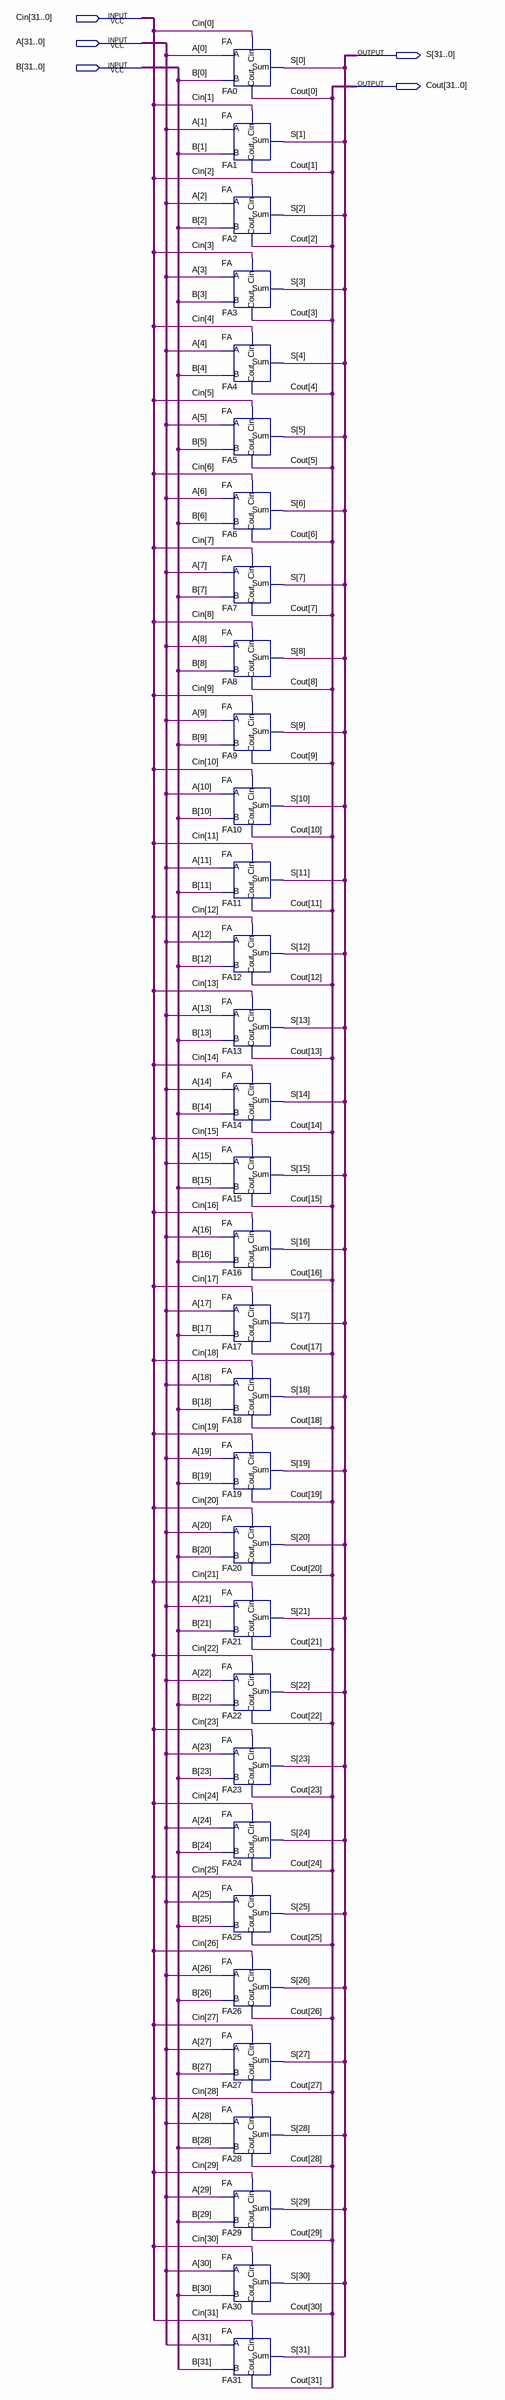
[diagram p0: schematic sheet]
// Quartus schematic CAS_32.bdf as structural Verilog: 32 symbols, 5 pins
module CAS_32 (
  input  [31:0] Cin,
  input  [31:0] A,
  input  [31:0] B,
  output [31:0] S,
  output [31:0] Cout
);

  FA FA0 (.A(A[0]), .B(B[0]), .Cin(Cin[0]), .Sum(S[0]), .Cout(Cout[0]));
  FA FA1 (.A(A[1]), .B(B[1]), .Cin(Cin[1]), .Sum(S[1]), .Cout(Cout[1]));
  FA FA2 (.A(A[2]), .B(B[2]), .Cin(Cin[2]), .Sum(S[2]), .Cout(Cout[2]));
  FA FA3 (.A(A[3]), .B(B[3]), .Cin(Cin[3]), .Sum(S[3]), .Cout(Cout[3]));
  FA FA4 (.A(A[4]), .B(B[4]), .Cin(Cin[4]), .Sum(S[4]), .Cout(Cout[4]));
  FA FA5 (.A(A[5]), .B(B[5]), .Cin(Cin[5]), .Sum(S[5]), .Cout(Cout[5]));
  FA FA6 (.A(A[6]), .B(B[6]), .Cin(Cin[6]), .Sum(S[6]), .Cout(Cout[6]));
  FA FA7 (.A(A[7]), .B(B[7]), .Cin(Cin[7]), .Sum(S[7]), .Cout(Cout[7]));
  FA FA8 (.A(A[8]), .B(B[8]), .Cin(Cin[8]), .Sum(S[8]), .Cout(Cout[8]));
  FA FA9 (.A(A[9]), .B(B[9]), .Cin(Cin[9]), .Sum(S[9]), .Cout(Cout[9]));
  FA FA10 (.A(A[10]), .B(B[10]), .Cin(Cin[10]), .Sum(S[10]), .Cout(Cout[10]));
  FA FA11 (.A(A[11]), .B(B[11]), .Cin(Cin[11]), .Sum(S[11]), .Cout(Cout[11]));
  FA FA12 (.A(A[12]), .B(B[12]), .Cin(Cin[12]), .Sum(S[12]), .Cout(Cout[12]));
  FA FA13 (.A(A[13]), .B(B[13]), .Cin(Cin[13]), .Sum(S[13]), .Cout(Cout[13]));
  FA FA14 (.A(A[14]), .B(B[14]), .Cin(Cin[14]), .Sum(S[14]), .Cout(Cout[14]));
  FA FA15 (.A(A[15]), .B(B[15]), .Cin(Cin[15]), .Sum(S[15]), .Cout(Cout[15]));
  FA FA16 (.A(A[16]), .B(B[16]), .Cin(Cin[16]), .Sum(S[16]), .Cout(Cout[16]));
  FA FA17 (.A(A[17]), .B(B[17]), .Cin(Cin[17]), .Sum(S[17]), .Cout(Cout[17]));
  FA FA18 (.A(A[18]), .B(B[18]), .Cin(Cin[18]), .Sum(S[18]), .Cout(Cout[18]));
  FA FA19 (.A(A[19]), .B(B[19]), .Cin(Cin[19]), .Sum(S[19]), .Cout(Cout[19]));
  FA FA20 (.A(A[20]), .B(B[20]), .Cin(Cin[20]), .Sum(S[20]), .Cout(Cout[20]));
  FA FA21 (.A(A[21]), .B(B[21]), .Cin(Cin[21]), .Sum(S[21]), .Cout(Cout[21]));
  FA FA22 (.A(A[22]), .B(B[22]), .Cin(Cin[22]), .Sum(S[22]), .Cout(Cout[22]));
  FA FA23 (.A(A[23]), .B(B[23]), .Cin(Cin[23]), .Sum(S[23]), .Cout(Cout[23]));
  FA FA24 (.A(A[24]), .B(B[24]), .Cin(Cin[24]), .Sum(S[24]), .Cout(Cout[24]));
  FA FA25 (.A(A[25]), .B(B[25]), .Cin(Cin[25]), .Sum(S[25]), .Cout(Cout[25]));
  FA FA26 (.A(A[26]), .B(B[26]), .Cin(Cin[26]), .Sum(S[26]), .Cout(Cout[26]));
  FA FA27 (.A(A[27]), .B(B[27]), .Cin(Cin[27]), .Sum(S[27]), .Cout(Cout[27]));
  FA FA28 (.A(A[28]), .B(B[28]), .Cin(Cin[28]), .Sum(S[28]), .Cout(Cout[28]));
  FA FA29 (.A(A[29]), .B(B[29]), .Cin(Cin[29]), .Sum(S[29]), .Cout(Cout[29]));
  FA FA30 (.A(A[30]), .B(B[30]), .Cin(Cin[30]), .Sum(S[30]), .Cout(Cout[30]));
  FA FA31 (.A(A[31]), .B(B[31]), .Cin(Cin[31]), .Sum(S[31]), .Cout(Cout[31]));
endmodule
